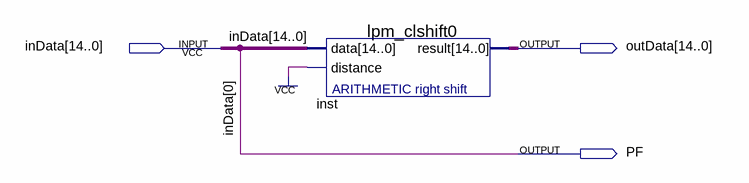
[diagram p0: schematic sheet]
// Quartus schematic ALU_SRA.bdf as structural Verilog: 1 symbols, 3 pins
module ALU_SRA (
  input  [14:0] inData,
  output [14:0] outData,
  output PF
);

  lpm_clshift0 inst (.distance(1'b1), .data(inData), .result(outData));

  assign PF = inData[0];
endmodule
